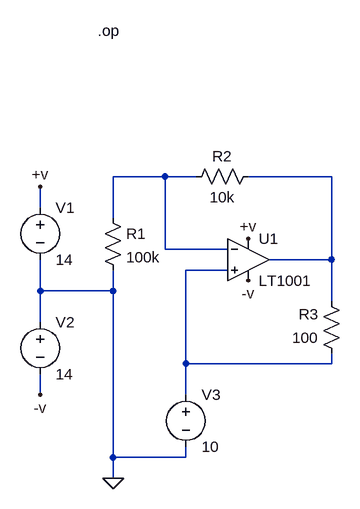
[diagram p0: schematic Draft1.asc]
Draft1.asc, the LTspice schematic file:
Version 4
SHEET 1 880 680
WIRE 80 16 0 16
WIRE 128 16 80 16
WIRE 336 16 208 16
WIRE -112 64 -112 32
WIRE 0 80 0 16
WIRE 80 128 80 16
WIRE 176 128 80 128
WIRE 336 144 336 16
WIRE 336 144 240 144
WIRE 176 160 112 160
WIRE -112 192 -112 144
WIRE 0 192 0 160
WIRE 0 192 -112 192
WIRE 336 208 336 144
WIRE -112 240 -112 192
WIRE 112 304 112 160
WIRE 336 304 336 288
WIRE 336 304 112 304
WIRE -112 352 -112 320
WIRE 112 352 112 304
WIRE 0 448 0 192
WIRE 112 448 112 432
WIRE 112 448 0 448
WIRE 0 480 0 448
FLAG 0 480 0
FLAG -112 32 +v
FLAG 208 112 +v
FLAG -112 352 -v
FLAG 208 176 -v
SYMBOL OpAmps\\LT1001 208 80 R0
SYMATTR InstName U1
SYMBOL voltage -112 48 R0
WINDOW 123 0 0 Left 0
WINDOW 39 0 0 Left 0
SYMATTR InstName V1
SYMATTR Value 14
SYMBOL voltage -112 224 R0
WINDOW 123 0 0 Left 0
WINDOW 39 0 0 Left 0
SYMATTR InstName V2
SYMATTR Value 14
SYMBOL voltage 112 336 R0
WINDOW 123 0 0 Left 0
WINDOW 39 0 0 Left 0
SYMATTR InstName V3
SYMATTR Value 10
SYMBOL res -16 64 R0
SYMATTR InstName R1
SYMATTR Value 100k
SYMBOL res 224 0 R90
WINDOW 0 0 56 VBottom 2
WINDOW 3 32 56 VTop 2
SYMATTR InstName R2
SYMATTR Value 10k
SYMBOL res 352 304 R180
WINDOW 0 36 76 Left 2
WINDOW 3 36 40 Left 2
SYMATTR InstName R3
SYMATTR Value 100
TEXT -24 -208 Left 2 !.op

The netlist it stands for:
* Draft1.asc
XU1 N003 N001 +v -v N002 LT1001  ; pins In+ In- V+ V- OUT
V1 +v 0 14
V2 0 -v 14
V3 N003 0 10
R1 N001 0 100k
R2 N002 N001 10k
R3 N003 N002 100
.op
.lib LTC.lib
.backanno
.end